# Altium schematic sheet LCD_Interface.SchDoc
size A; SheetNumber: 7; SheetTotal: 10
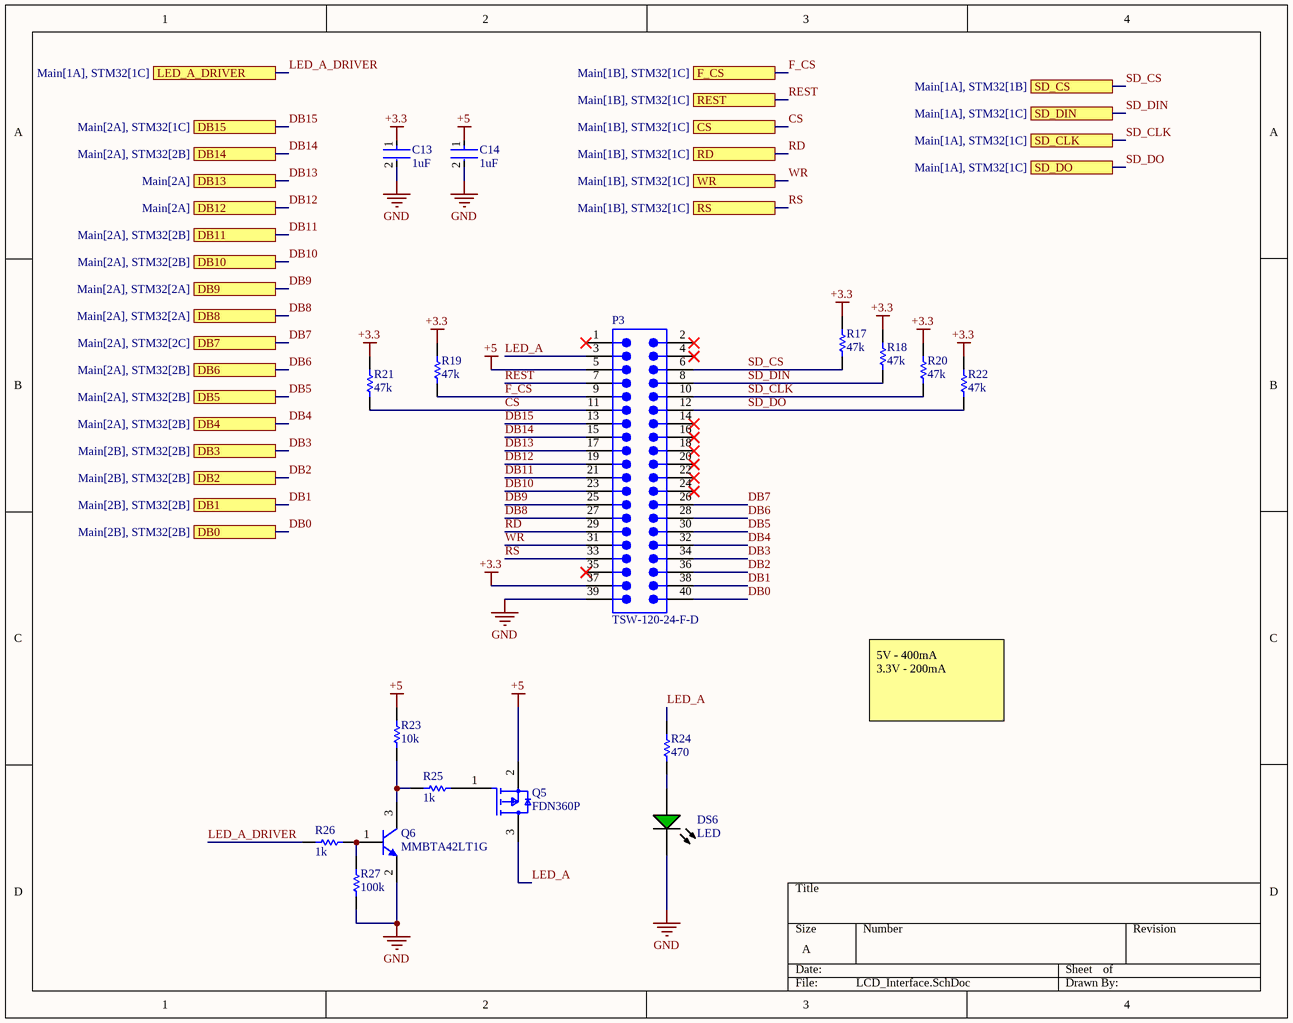
[diagram p0: LCD_Interface.SchDoc]

## Parts
C13  1uF  [FP-0805-L_2_01_0_2-W_1_25-IPC_B]
C14  1uF  [FP-0805-L_2_01_0_2-W_1_25-IPC_B]
DS6  LED  [AVAG-HSMX-C170_V]
P3  TSW-120-24-F-D  [SMTC-TSW-120-24-X-D]
Q5  FDN360P  [FP-527AG-IPC_B]
Q6  MMBTA42LT1G  [ONSC-SOT-23-3-318-08_V]
R17  47k  [RESC2013X50X30LL20T20]
R18  47k  [RESC2013X50X30LL20T20]
R19  47k  [RESC2013X50X30LL20T20]
R20  47k  [RESC2013X50X30LL20T20]
R21  47k  [RESC2013X50X30LL20T20]
R22  47k  [RESC2013X50X30LL20T20]
R23  10k  [RESC2013X50X30LL20T20]
R24  470  [RESC2013X50X30LL20T20]
R25  1k  [RESC2013X50X30LL20T20]
R26  1k  [RESC2013X50X30LL20T20]
R27  100k  [RESC2013X50X30LL20T20]

## Ports
CS (see Main[1B], STM32[1C]), DB0 (see Main[2B], STM32[2B]), DB1 (see Main[2B], STM32[2B]), DB2 (see Main[2B], STM32[2B]), DB3 (see Main[2B], STM32[2B]), DB4 (see Main[2A], STM32[2B]), DB5 (see Main[2A], STM32[2B]), DB6 (see Main[2A], STM32[2B]), DB7 (see Main[2A], STM32[2C]), DB8 (see Main[2A], STM32[2A]), DB9 (see Main[2A], STM32[2A]), DB10 (see Main[2A], STM32[2B]), DB11 (see Main[2A], STM32[2B]), DB12 (see Main[2A]), DB13 (see Main[2A]), DB14 (see Main[2A], STM32[2B]), DB15 (see Main[2A], STM32[1C]), F_CS (see Main[1B], STM32[1C]), LED_A_DRIVER (see Main[1A], STM32[1C]), RD (see Main[1B], STM32[1C]), REST (see Main[1B], STM32[1C]), RS (see Main[1B], STM32[1C]), SD_CLK (see Main[1A], STM32[1C]), SD_CS (see Main[1A], STM32[1B]), SD_DIN (see Main[1A], STM32[1C]), SD_DO (see Main[1A], STM32[1C]), WR (see Main[1B], STM32[1C])

## Nets
+3.3: C13.1 P3.37 R17.2 R18.2 R19.2 R20.2 R21.2 R22.2
+5: C14.1 P3.5 Q5.2(S) R23.2
GND: C13.2 C14.2 DS6.2(K) P3.39 Q6.2(E) R27.1
CS: P3.11 R21.1 ; port CS
DB0: P3.40 ; port DB0
DB1: P3.38 ; port DB1
DB2: P3.36 ; port DB2
DB3: P3.34 ; port DB3
DB4: P3.32 ; port DB4
DB5: P3.30 ; port DB5
DB6: P3.28 ; port DB6
DB7: P3.26 ; port DB7
DB8: P3.27 ; port DB8
DB9: P3.25 ; port DB9
DB10: P3.23 ; port DB10
DB11: P3.21 ; port DB11
DB12: P3.19 ; port DB12
DB13: P3.17 ; port DB13
DB14: P3.15 ; port DB14
DB15: P3.13 ; port DB15
F_CS: P3.9 R19.1 ; port F_CS
LED_A: P3.3 Q5.3(D) R24.2
LED_A_DRIVER: R26.1 ; port LED_A_DRIVER
RD: P3.29 ; port RD
REST: P3.7 ; port REST
RS: P3.33 ; port RS
SD_CLK: P3.10 R20.1 ; port SD_CLK
SD_CS: P3.6 R17.1 ; port SD_CS
SD_DIN: P3.8 R18.1 ; port SD_DIN
SD_DO: P3.12 R22.1 ; port SD_DO
WR: P3.31 ; port WR
NetDS6_1: DS6.1(A) R24.1
NetQ5_1: Q5.1(G) R25.2
NetQ6_1: Q6.1(B) R26.2 R27.2
NetQ6_3: Q6.3(C) R23.1 R25.1

Not connected (* = marked no-connect by the designer): P3 1* 2* 4* 14* 16* 18* 20* 22* 24* 35*

## Notes on the sheet
- 5V - 400mA
  3.3V - 200mA

## Library data of the parts
C13 C14 = CMP-2007-04174-2: General Purpose Ceramic Capacitor, 0805, 100nF, 10%, X7R, 15%, 100V; Packaging: Tape and Reel; Min Operating Temperature: -55°C; Dielectric Material: Ceramic; Height: 1.4mm; Voltage Rating: 100V; Termination: SMD/SMT; Case Code (Imperial): 0805; Case Code (Metric): 2012; Case/Package: 0805; Construction: Flat; Radiation Hardening: No; Series: -; Dielectric: X7R; Package Quantity: 2000; Mount: Surface Mount; Capacitance: 100nF; Contact Plating: Tin; Voltage: 100V; Lead Free: Lead Free; Depth: 1.25mm; RoHS Compliant: Yes; Number of Pins: 2; Max Operating Temperature: 125°C; Length: 2.01mm; Voltage Rating (DC): 100V; Thickness: 0.055inch; REACH SVHC: No SVHC; Width: 0.049inch; Tolerance: 10%
DS6 = CMP-2000-05062-1: Chip LED, Green, 2.2 V, -40 to 85 degC, 2-Pin SMD, Pb-Free, Tape and Reel; Manufacturer: Avago; No. of Pins: 2; Peak Wavelength: 570nm; SVHC: NoSVHC(16-Jun-2014); Dominant Wavelength: 572nm; Forward Current If: 20mA; Viewing Angle: 170deg; Lens Shape: Rectangular; PIV Max: 5V; External Width: 1.25mm; LED Type: Standard; External Depth: 0.8mm; Opto Mounting Orientation: Top; Luminous Intensity: 15mcd; Luminous Intensity Min: 4mcd; Forward Voltage VF Max: 2.6V; External Length / Height: 2mm; Bulb Size: 1.25mmx1.4mm; Light Area Height: 1mm; Voltage Vf Typ: 2.2V; Operating Temperature Max: 85degC; Datasheet Version: Oct-08; MSL: MSL2A-4weeks; Peak Forward Current: 20mA; Package Description: 2-Pin Surface Mount Device, Body 2 x 1.25 mm, Height 0.8 mm; Datasheet URL: https://datasheet.ciiva.com/29280/180495-da-01-en-chip-led-hsmg-c170-gelb-gruen-29280971.pdf; Storage Temperature Min: -40degC; LED Colour: Green; Wavelength Typ: 570nm; Mounting Type: SMD; Forward Current If Max: 20mA; Dominant Wavelength Typ: 572nm; LED Mounting: SMD; Operating Temperature Range: -30degCto+85degC; Operating Temperature Min: -30degC; Manufacturer URL: http://www.avagotech.com/; Packaging: CutTape; Luminous Intensity Typ: 15mcd; Package Reference: HSMX-C170; Storage Temperature Max: 85degC; Opto Case Style: SMD; Forward Voltage: 2.2V
P3 = CMP-1024-00453-1: 0.025" SQ Post Header, Through-hole, Vertical, -55 to 125 degC, 2.54 mm Pitch, 40-Pin, Male, RoHS; Manufacturer: Samtec; Pitch: 2.54 mm; ComponentLink2Description: Datasheet; Temperature Range: -55 to 125 degC; RoHS: True; ComponentLink1Description: Manufacturer URL; PackageReference: TSW-120-24-X-D; ComponentLink1URL: http://www.samtec.com; PartNumber: TSW-120-24-F-D; ComponentLink3Description: Package Specification; DatasheetVersion: F-214; PackageDescription: .025[0.64] SQ. Post Terminal Strip Assembly; Mounting Technology: Through-hole; Orientation: Vertical; PackageVersion: DM, 8/1988; ComponentLink3URL: http://www.samtec.com/documents/webfiles/cpdf/TSW-XXX-XX-XXX-X-XX-XXX-MKT.pdf; ComponentLink2URL: http://www.samtec.com/documents/webfiles/pdf/TSW_TH.PDF
Q5 = CMP-2000-07455-3: MOSFET P-CH 30V 2A SSOT3; Gate to Source Voltage (Vgs): 20V; Turn-On Delay Time: 6ns; Number of Elements: 1; Max Power Dissipation: 500mW; Rds On Max: 80mR; Input Capacitance: 298pF; Current Rating: -2A; Dual Supply Voltage: -30V; Element Configuration: Single; Turn-Off Delay Time: 11ns; Drain to Source Resistance: 63mR; Rise Time: 13ns; REACH SVHC: No SVHC; Radiation Hardening: No; Packaging: Tape and Reel; Mount: Surface Mount; Height: 0.94mm; Power Dissipation: 500mW; Case/Package: SOT-23; Width: 1.4mm; Continuous Drain Current (ID): 2A; Lead Free: Lead Free; Package Quantity: 1; Drain to Source Voltage (Vdss): 30V; Weight: 0.03g; Voltage Rating (DC): -30V; Threshold Voltage: 20V; On-State Resistance: 80MR; Number of Pins: 3; Drain to Source Breakdown Voltage: -30V; Max Operating Temperature: 150°C; Contact Plating: Tin; Length: 2.92mm; Min Operating Temperature: -55°C; Fall Time: 6ns
Q6 = CMP-1048-00662-1: High Voltage Transistor, NPN Silicon, 3-Pin SOT-23, Pb-Free, Tape and Reel; Manufacturer: On Semiconductor; fT Min (MHz): 50; IC Continuous (A): 0.5; ComponentLink1URL: http://www.onsemi.com/; ComponentLink3URL: http://www.onsemi.cn/pub_link/Collateral/318-08.PDF; RoHS: TRUE; ComponentLink2Description: Datasheet; PartNumber: MMBTA42LT1G; Polarity: NPN; DatasheetVersion: Rev. 12; PackageReference: SOT-23-3-318-08; PackageDescription: 3-Pin Small Outline Transistor, Body 2.92 x 1.3 mm, Pitch 0.95 mm; ComponentLink3Description: Package Specification; ComponentLink1Description: Manufacturer URL; Packing: Tape and Reel; PackageVersion: Rev. AP, 11/2009; Mounting Technology: Surface Mount; ComponentLink2URL: http://www.onsemi.cn/pub_link/Collateral/MMBTA42LT1-D.PDF
R17-R27 = CMP-2001-04896-1: Manufacturer: Vishay Dale; Part Number: CRCW08050000Z0EA